# Altium schematic sheet cs301_Group_12.SchDoc
size B; SheetNumber: 1; SheetTotal: 2
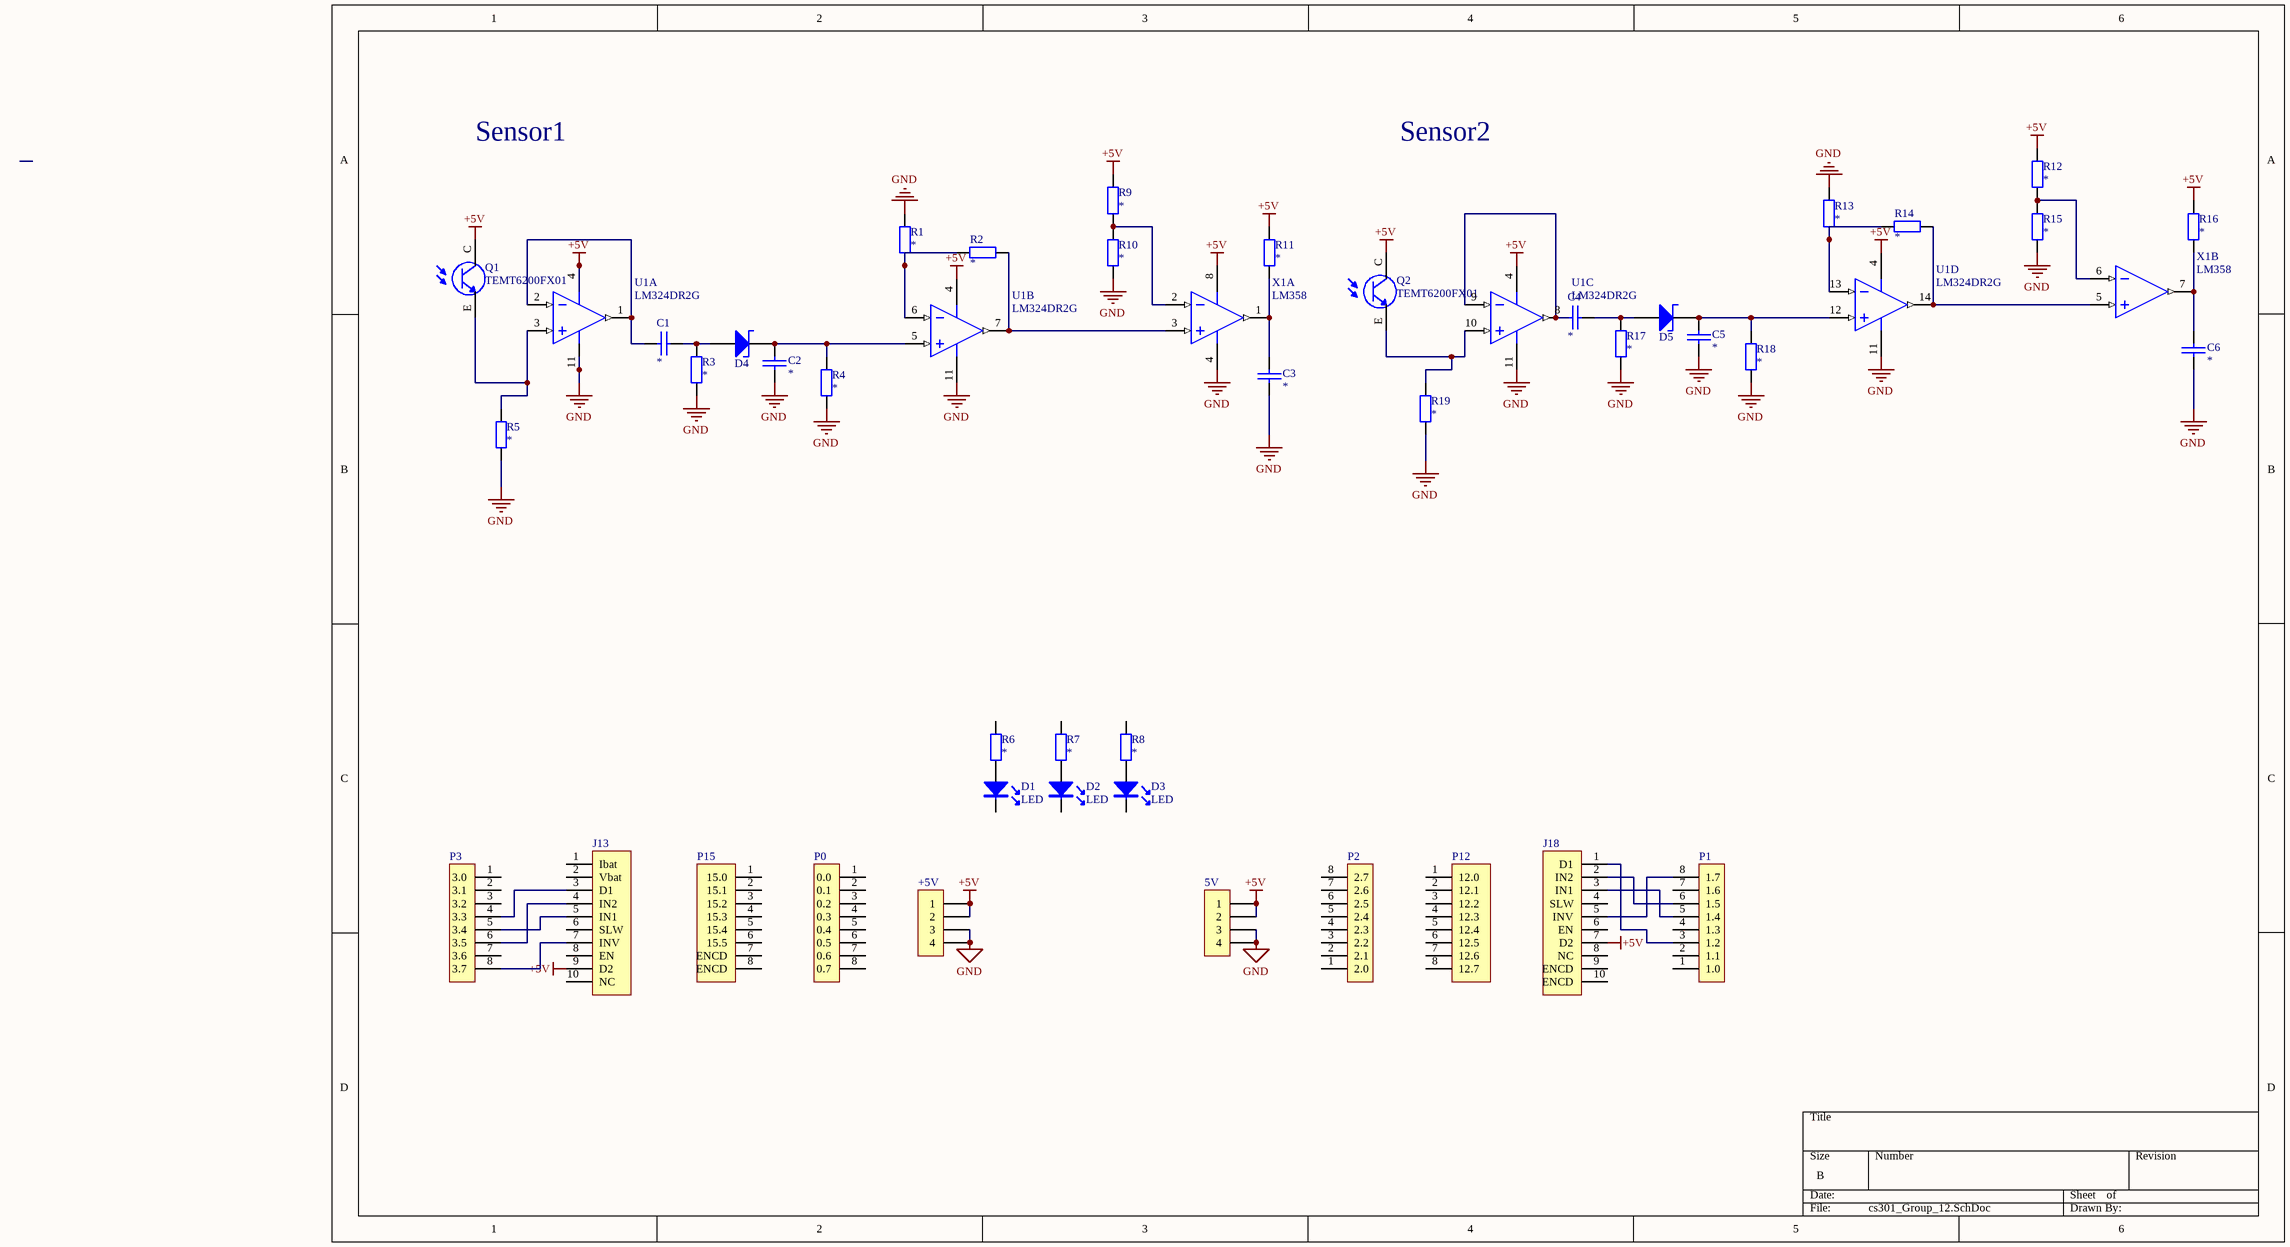
[diagram p0: cs301_Group_12.SchDoc]

## Parts
5V  5V  [IDC4]  (value not drawn)
+5V  5V  [IDC4]  (value not drawn)
C1  *  [0805 CAP]
C2  *  [0805 CAP]
C3  *  [0805 CAP]
C4  *  [0805 CAP]
C5  *  [0805 CAP]
C6  *  [0805 CAP]
D1  LED  [LED0.1/5MM]
D2  LED  [LED0.1/5MM]
D3  LED  [LED0.1/5MM]
D4  BZT52H-B4V7  [SOD123]  (value not drawn)
D5  BZT52H-B4V7  [SOD123]  (value not drawn)
J13  CON10  [idc10]  (value not drawn)
J18  CON10  [IDC10]  (value not drawn)
P0  P0  [idc8]  (value not drawn)
P1  P1  [idc8]  (value not drawn)
P2  P2  [idc8]  (value not drawn)
P3  P3  [idc8]  (value not drawn)
P12  P12  [idc8]  (value not drawn)
P15  P15  [idc8]  (value not drawn)
Q1  TEMT6200FX01  [XDCR_TEMT6200FX01]
Q2  TEMT6200FX01  [XDCR_TEMT6200FX01]
R1  *  [0805 RES]
R2  *  [0805 RES]
R3  *  [0805 RES]
R4  *  [0805 RES]
R5  *  [0805 RES]
R6  *  [0805 RES]
R7  *  [0805 RES]
R8  *  [0805 RES]
R9  *  [0805 RES]
R10  *  [0805 RES]
R11  *  [0805 RES]
R12  *  [0805 RES]
R13  *  [0805 RES]
R14  *  [0805 RES]
R15  *  [0805 RES]
R16  *  [0805 RES]
R17  *  [0805 RES]
R18  *  [0805 RES]
R19  *  [0805 RES]
U1  LM324DR2G  [SOIC-14]  (parts A,B,C,D of 4)
X1  LM358  [SO - 8]  (parts A,B of 2)

## Nets
+5V: 5V.1 5V.2 +5V.1 +5V.2 J13.9(D2) J18.7(D2) Q1.C Q2.C R9.1 R11.1 R12.1 R16.1 U1.4(VCC) X1.8(VDD)
GND: 5V.3 5V.4 +5V.3 +5V.4 C2.2 C3.2 C5.2 C6.2 R1.2 R3.1 R4.1 R5.1 R10.2 R13.2 R15.2 R17.1 R18.1 R19.1 U1.11(VEE/GND) X1.4(VSS)
NetC1_1: C1.1 U1.1(OUT1) U1.2(IN1-)
NetC1_2: C1.2 D4.1(A) R3.2
NetC2_1: C2.1 D4.2(K) R4.2 U1.5(IN2+)
NetC3_1: C3.1 R11.2 X1.1(VOUTA)
NetC4_1: C4.1 U1.8(OUT3) U1.9(IN3-)
NetC4_2: C4.2 D5.1(A) R17.2
NetC5_1: C5.1 D5.2(K) R18.2 U1.12(IN4+)
NetC6_1: C6.1 R16.2 X1.7(VOUTA)
NetD1_A: D1.A R6.1
NetD2_A: D2.A R7.1
NetD3_A: D3.A R8.1
NetJ13_3: J13.3(D1) P3.4(3.3)
NetJ13_4: J13.4(IN2) P3.6(3.5)
NetJ13_5: J13.5(IN1) P3.5(3.4)
NetJ13_7: J13.7(INV) P3.8(3.7)
NetJ18_1: J18.1(D1) P1.3(1.2)
NetJ18_2: J18.2(IN2) P1.6(1.5)
NetJ18_3: J18.3(IN1) P1.5(1.4)
NetJ18_5: J18.5(INV) P1.8(1.7)
NetQ1_E: Q1.E R5.2 U1.3(IN1+)
NetQ2_E: Q2.E R19.2 U1.10(IN3+)
NetR1_1: R1.1 R2.2 U1.6(IN2-)
NetR2_1: R2.1 U1.7(OUT2) X1.3(VINA+)
NetR9_2: R9.2 R10.1 X1.2(VINA-)
NetR12_2: R12.2 R15.1 X1.6(VINA-)
NetR13_1: R13.1 R14.2 U1.13(IN4-)
NetR14_1: R14.1 U1.14(OUT4) X1.5(VINA+)

Not connected (* = marked no-connect by the designer): D1 K(2); D2 K(2); D3 K(2); J13 1(Ibat) 2(Vbat) 6(SLW) 8(EN) 10(NC); J18 4(SLW) 6(EN) 8(NC) 9(ENCD) 10(ENCD); P0 1(0.0) 2(0.1) 3(0.2) 4(0.3) 5(0.4) 6(0.5) 7(0.6) 8(0.7); P1 1(1.0) 2(1.1) 4(1.3) 7(1.6); P2 1(2.0) 2(2.1) 3(2.2) 4(2.3) 5(2.4) 6(2.5) 7(2.6) 8(2.7); P3 1(3.0) 2(3.1) 3(3.2) 7(3.6); P12 1(12.0) 2(12.1) 3(12.2) 4(12.3) 5(12.4) 6(12.5) 7(12.6) 8(12.7); P15 1(15.0) 2(15.1) 3(15.2) 4(15.3) 5(15.4) 6(15.5) 7(ENCD) 8(ENCD); R6 2; R7 2; R8 2

## Notes on the sheet
- Sensor1
- Sensor2

## Library data of the parts
5V +5V = CON4: Connector
C1-C6 = CerCap_SMT_0805: SMT ceramic capacitor 0805 size; Value: *
D4 D5 = Zener_SMT_SOD123: SMT zener diode with SOD123 package; Manufacturer: Nexperia USA Inc.; Manufacturer Part Number: BZT52H-B4V7,115; Tolerance: ±2%; Supplier 1: Digi-Key; RoHS: RoHS Compliant; Category: Discrete Semiconductor Products; Stock 1: 0; Pricing 1: 1=0.51, 10=0.408, 100=0.2164, 500=0.14232, 1000=0.09678 (NZD); Packaging: Cut Tape (CT); Part Status: Active; Operating Temperature: -65°C ~ 150°C (TA); Mounting Type: Surface Mount; Package / Case: SOD-123F; Supplier Device Package: SOD-123F; ComponentLink1URL: https://assets.nexperia.com/documents/data-sheet/BZT52H_SER.pdf; ComponentLink1Description: https://assets.nexperia.com/documents/data-sheet/BZT52H_SER.pdf; Supplier Part Number 1: 1727-1611-1-ND
J13 J18 = CON10: Connector
P0-P3 = CON8: Connector
P12 P15 = CON8_1: Connector
Q1 Q2 = TEMT6200FX01: Phototransistors 550nm Top View 0805 (2012 Metric); MF: Vishay Semiconductor; Price: None; Package: 0805 Vishay Semiconductor; Check_prices: https://www.snapeda.com/parts/TEMT6200FX01/Vishay%20Semiconductor%20Opto%20Division/view-part/43955/?ref=eda; Purchase-URL: https://pricing.snapeda.com/search/part/TEMT6200FX01/?ref=eda; MP: TEMT6200FX01; Value: *; SnapEDA_Link: https://www.snapeda.com/parts/TEMT6200FX01/Vishay%20Semiconductor%20Opto%20Division/view-part/43955/?ref=snap; Availability: Good
R1-R19 = Res_SMT_0805: 0805 resistor; Published: 8-Jun-2000; LatestRevisionDate: 17-Jul-2002; LatestRevisionNote: Re-released for DXP Platform.; PackageReference: AXIAL-0.4; Publisher: Altium Limited; Value: *; ComponentLink1Description: https://nz.mouser.com/datasheet/2/315/AOA0000C304-1149620.pdf
U1 = LM324DR_SMT_SOIC16: Single Supply Quad Operational Amplifier, 3 to 32 V, 0 to 70 degC, 14-Pin SOIC, Pb-Free, Tape and Reel; Manufacturer: On Semiconductor; VCC Max (V): 32; VCC Min (V): 3; PackageVersion: Rev. K, 05/2011; ComponentLink3URL: http://www.onsemi.com/pub_link/Collateral/751A-03.PDF; ComponentLink3Description: Package Specification; Packing: Tape and Reel; ComponentLink2URL: http://www.onsemi.cn/pub_link/Collateral/LM324-D.PDF; PackageReference: SOIC-14-751A-03; ComponentLink1URL: http://www.onsemi.com/; PackageDescription: 14-Pin Small Outline Integrated Circuit, Body 8.65 x 3.9 mm, Pitch 1.27 mm; ComponentLink1Description: Manufacturer URL; DatasheetVersion: Rev. 25; Mounting Technology: Surface Mount; RoHS: TRUE; ComponentLink2Description: Datasheet; PartNumber: LM324DR2G
X1 = LM358_SMT_SOIC8: IC OPAMP 8SOIC; ComponentLink1URL: http://www.ti.com/lit/ds/symlink/tlc080a.pdf; ComponentLink1Description: http://www.ti.com/lit/ds/symlink/tlc080a.pdf; Supplier 1: Digi-Key; Supplier Part Number 1: 296-1014-1-ND